# EAGLE design MultiPD (EAGLE 5.10)
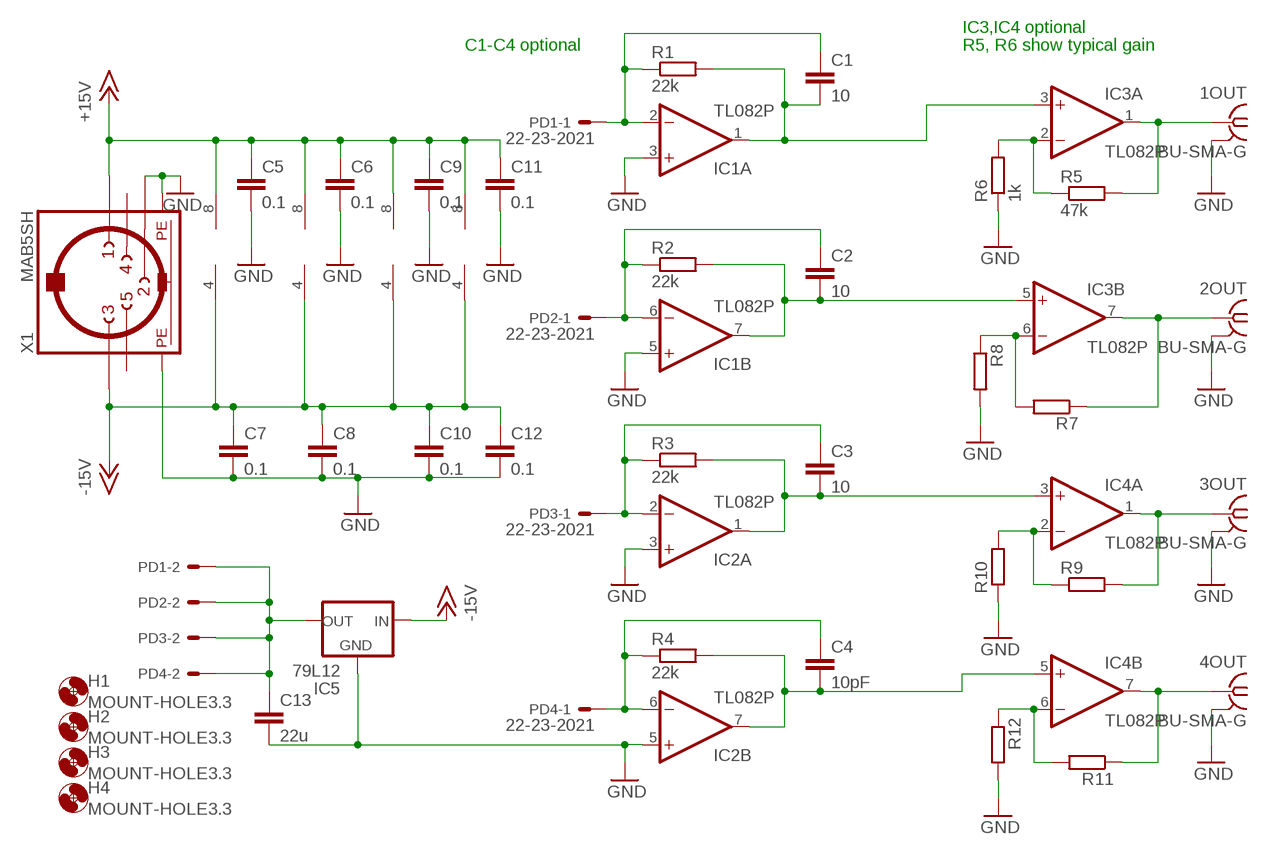
[diagram p0: schematic, sheet 1]

## Parts
1OUT  BU-SMA-G  [BU-SMA-G]
2OUT  BU-SMA-G  [BU-SMA-G]
3OUT  BU-SMA-G  [BU-SMA-G]
4OUT  BU-SMA-G  [BU-SMA-G]
C1  10  C-EU050-035X075  [C050-035X075]
C2  10  C-EU050-035X075  [C050-035X075]
C3  10  C-EU050-035X075  [C050-035X075]
C4  10pF  C-EU050-035X075  [C050-035X075]
C5  0.1  C-EU025-030X050  [C025-030X050]
C6  0.1  C-EU025-030X050  [C025-030X050]
C7  0.1  C-EU025-030X050  [C025-030X050]
C8  0.1  C-EU025-030X050  [C025-030X050]
C9  0.1  C-EU025-030X050  [C025-030X050]
C10  0.1  C-EU025-030X050  [C025-030X050]
C11  0.1  C-EU025-030X050  [C025-030X050]
C12  0.1  C-EU025-030X050  [C025-030X050]
C13  22u  C-EU050-025X075  [C050-025X075]
H1  MOUNT-HOLE3.3  [3,3]
H2  MOUNT-HOLE3.3  [3,3]
H3  MOUNT-HOLE3.3  [3,3]
H4  MOUNT-HOLE3.3  [3,3]
IC1  TL082P  [DIL08]
IC2  TL082P  [DIL08]
IC3  TL082P  [DIL08]
IC4  TL082P  [DIL08]
IC5  79L12  79LXX  [79LXX]
PD1  22-23-2021  [22-23-2021]
PD2  22-23-2021  [22-23-2021]
PD3  22-23-2021  [22-23-2021]
PD4  22-23-2021  [22-23-2021]
R1  22k  R-EU_0207/10  [0207/10]
R2  22k  R-EU_0207/10  [0207/10]
R3  22k  R-EU_0207/10  [0207/10]
R4  22k  R-EU_0207/10  [0207/10]
R5  47k  R-EU_0207/10  [0207/10]
R6  1k  R-EU_0207/10  [0207/10]
R7  R-EU_0207/10  [0207/10]
R8  R-EU_0207/10  [0207/10]
R9  R-EU_0207/10  [0207/10]
R10  R-EU_0207/10  [0207/10]
R11  R-EU_0207/10  [0207/10]
R12  R-EU_0207/10  [0207/10]
X1  MAB5SH  [MAB5SH]

## Nets
+15V: C5.1 C6.1 C9.1 C11.1 IC1.8(P:V+) IC2.8(P:V+) IC3.8(P:V+) IC4.8(P:V+) X1.1
-15V: C7.1 C8.1 C10.1 C12.1 IC1.4(P:V-) IC2.4(P:V-) IC3.4(P:V-) IC4.4(P:V-) IC5.IN X1.3
GND: 1OUT.2(GND) 2OUT.2(GND) 3OUT.2(GND) 4OUT.2(GND) C5.2 C6.2 C7.2 C8.2 C9.2 C10.2 C11.2 C12.2 C13.2 IC1.3(A:+IN) IC1.5(B:+IN) IC2.3(A:+IN) IC2.5(B:+IN) IC5.GND R6.1 R8.2 R10.1 R12.2 X1.2 X1.PE X1.PE@(PE)
N$1: C1.1 IC1.2(A:-IN) PD1.1 R1.1
N$2: C2.1 IC1.6(B:-IN) PD2.1 R2.1
N$3: C3.1 IC2.2(A:-IN) PD3.1 R3.1
N$4: C4.1 IC2.6(B:-IN) PD4.1 R4.1
N$5: C1.2 IC1.1(A:OUT) IC3.3(A:+IN) R1.2
N$6: C2.2 IC1.7(B:OUT) IC3.5(B:+IN) R2.2
N$7: C3.2 IC2.1(A:OUT) IC4.3(A:+IN) R3.2
N$8: C4.2 IC2.7(B:OUT) IC4.5(B:+IN) R4.2
N$9: IC3.2(A:-IN) R5.1 R6.2
N$10: IC3.6(B:-IN) R7.2 R8.1
N$11: IC4.2(A:-IN) R9.1 R10.2
N$12: IC4.6(B:-IN) R11.2 R12.1
N$13: 1OUT.1 IC3.1(A:OUT) R5.2
N$14: 2OUT.1 IC3.7(B:OUT) R7.1
N$15: 3OUT.1 IC4.1(A:OUT) R9.2
N$16: 4OUT.1 IC4.7(B:OUT) R11.1
N$17: C13.1 IC5.OUT PD1.2 PD2.2 PD3.2 PD4.2
Unconnected: X1.4 X1.5

## Notes on the sheet
- IC3,IC4 optional
- C1-C4 optional | R5, R6 show typical gain

## Power pins joined to a net without a drawn wire
GND: 1OUT.3(GND) 1OUT.4(GND) 1OUT.5(GND) 2OUT.3(GND) 2OUT.4(GND) 2OUT.5(GND) 3OUT.3(GND) 3OUT.4(GND) 3OUT.5(GND) 4OUT.3(GND) 4OUT.4(GND) 4OUT.5(GND)

## Library data of the parts
1OUT 2OUT 3OUT 4OUT = con-coax:BU-SMA-G: FEMALE SMA CONNECTOR Radiall distributor RS 193-9117
C1-C13 = rcl:C-EU: CAPACITOR, European symbol
H1-H4 = holes:MOUNT-HOLE: MOUNTING HOLE with drill center marker
IC1-IC4 = linear:TL082: OP AMP
IC5 = v-reg:79LXX: VOLTAGE REGULATOR
PD1-PD4 = con-molex:22-23-2021: .100" (2.54mm) Center Header - 2 Pin
R1-R12 = rcl:R-EU_: RESISTOR, European symbol
X1 = con-hirschmann:MAB5SH: Female CONNECTOR 5 pins 90 deg. with shield, horizontal (DIN 41524)

## Board
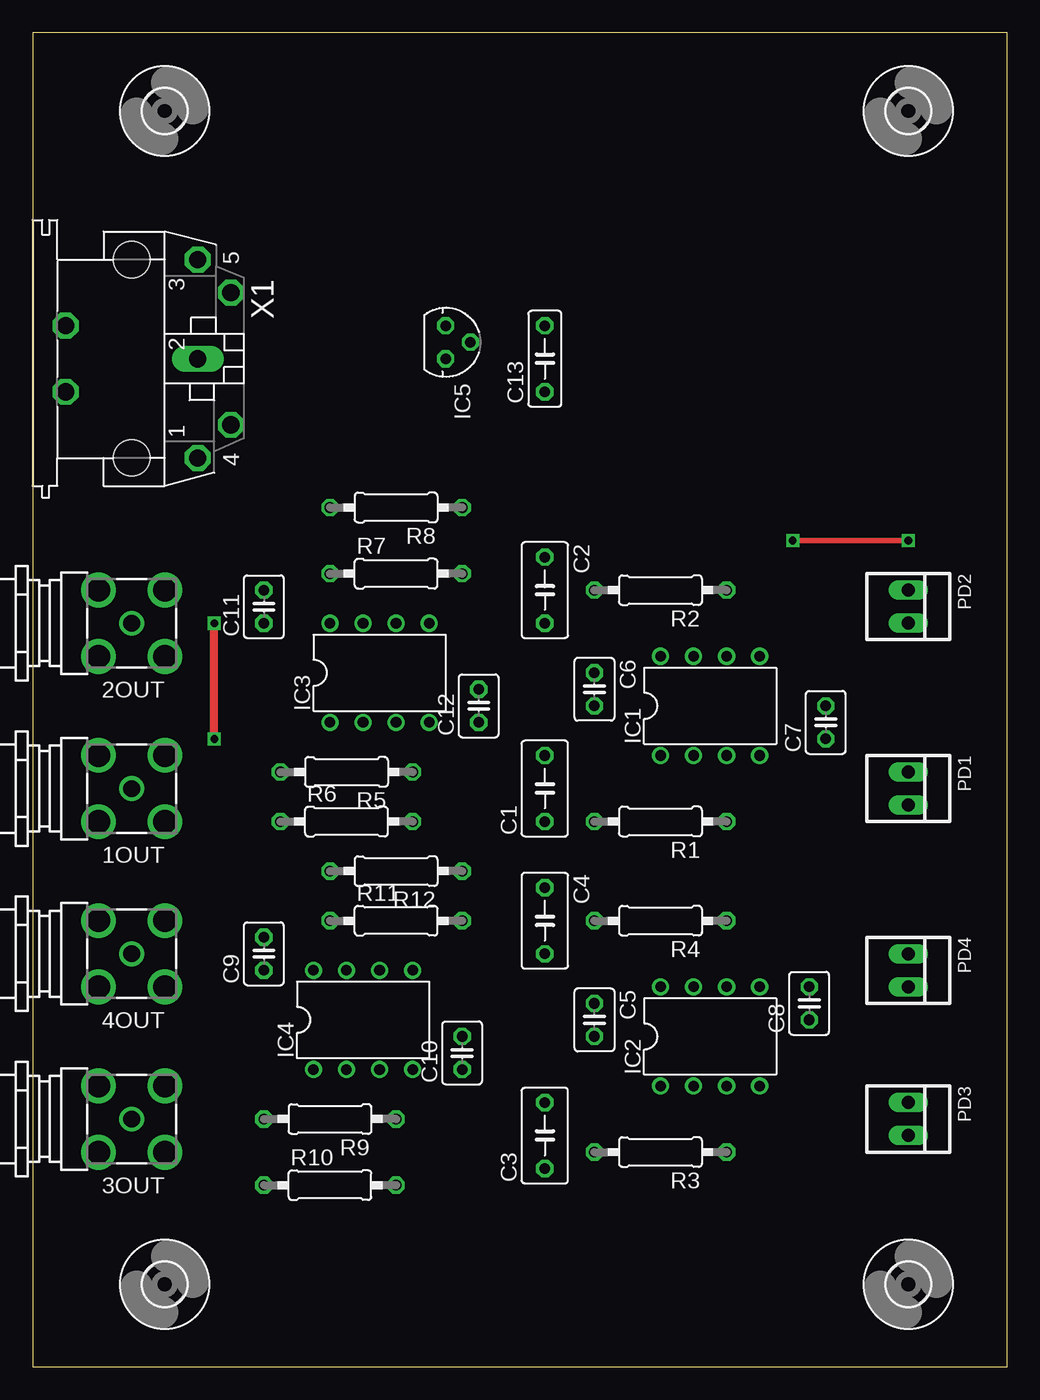
[diagram p1: board, top side]
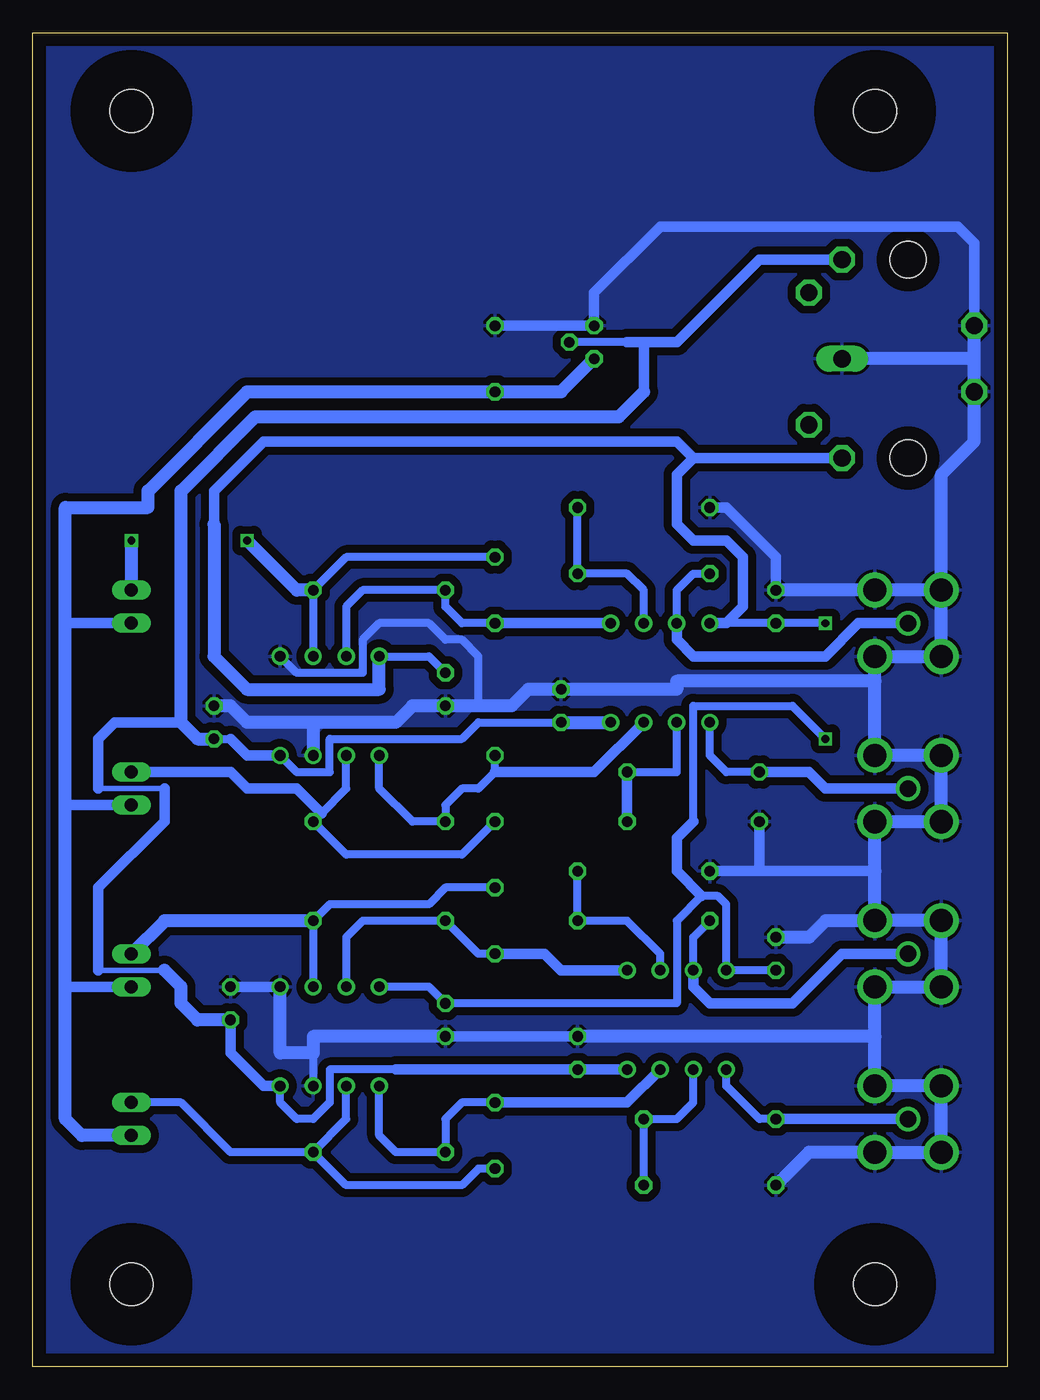
[diagram p2: board, bottom side, seen from below]

Size 74.91 x 102.54 mm. Coordinates in mm from the lower left corner, seen from the top.
Outline: 0,0 74.91,0 74.91,102.54 0,102.54 0,0
Copper layers (1*16): Top 0.035mm / dielectric 1.5mm / Bottom 0.035mm
Design rules "default": minimum track width 10mil, minimum drill 24mil, track to track 8mil, track to pad 8mil, pad to pad 8mil, via to via 8mil, smd to smd 8mil, copper to edge 40mil, drill to drill 8mil, minimum pad ring 10mil, minimum via ring 8mil, stop-mask expansion 4mil, vias tented up to drill 0mil, thermal gap 10mil

### Footprints (pad centres in the part's own frame; a part is rotated, then mirrored left to right if it is on the bottom)
BU-SMA-G = drill 1.27 round: 1 0,0 | drill 1.778 round: 2 -2.55,2.55; 3 2.55,2.55; 4 2.55,-2.55; 5 -2.55,-2.55
C050-035X075 = drill 0.813 octagon: 1 -2.54,0; 2 2.54,0
C025-030X050 = drill 0.813 octagon: 1 -1.27,0; 2 1.27,0
C050-025X075 = drill 0.813 octagon: 1 -2.54,0; 2 2.54,0
3,3 = hole 3.3: 0,0
DIL08 = drill 0.813 pad 1.27 round: 1 -3.81,-3.81; 2 -1.27,-3.81; 3 1.27,-3.81; 4 3.81,-3.81; 5 3.81,3.81; 6 1.27,3.81; 7 -1.27,3.81; 8 -3.81,3.81
79LXX = drill 0.813 octagon: GND -1.27,0; IN 0,1.905; OUT 1.27,0
22-23-2021 = drill 1 long: 1 -1.27,0; 2 1.27,0
0207/10 = drill 0.813 octagon: 1 -5.08,0; 2 5.08,0
MAB5SH = drill 1.321 octagon: 1 7.62,5.08; 3 -7.62,5.08; 4 5.08,7.62; 5 -5.08,7.62; PE -2.54,-5.08; PE@ 2.54,-5.08 | drill 1.321 long: 2 0,5.08 | hole 2.794: 7.62,0; -7.62,0

### Placement (x,y rotation side)
1OUT  7.62,44.45 180 top
2OUT  7.62,57.15 180 top
3OUT  7.62,19.05 180 top
4OUT  7.62,31.75 180 top
C1  39.37,44.45 90 top
C2  39.37,59.69 270 top
C3  39.37,17.78 90 top
C4  39.37,34.29 270 top
C5  43.18,26.67 270 top
C6  43.18,52.07 270 top
C7  60.96,49.53 90 top
C8  59.69,27.94 90 top
C9  17.78,31.75 90 top
C10  33.02,24.13 90 top
C11  17.78,58.42 90 top
C12  34.29,50.8 90 top
C13  39.37,77.47 90 top
H1  67.31,96.52 0 top
H2  10.16,6.35 0 top
H3  67.31,6.35 0 top
H4  10.16,96.52 0 top
IC1  52.07,50.8 0 top
IC2  52.07,25.4 0 top
IC3  26.67,53.34 0 top
IC4  25.4,26.67 0 top
IC5  31.75,78.74 270 top
PD1  67.31,44.45 270 top
PD2  67.31,58.42 270 top
PD3  67.31,19.05 270 top
PD4  67.31,30.48 270 top
R1  48.26,41.91 180 top
R2  48.26,59.69 180 top
R3  48.26,16.51 180 top
R4  48.26,34.29 180 top
R5  24.13,45.72 180 top
R6  24.13,41.91 0 top
R7  27.94,60.96 0 top
R8  27.94,66.04 180 top
R9  22.86,19.05 180 top
R10  22.86,13.97 0 top
R11  27.94,34.29 0 top
R12  27.94,38.1 180 top
X1  7.62,77.47 270 top

### Tracks (layer width: path | path; a pad name or v marks a point on that pad's centre or on a via)
+15V  (via drill 0.6)
  Top 0.61: v13.97,48.26 v13.97,57.15
  Bottom 0.61: C6.1 44.45,54.61 IC1.8 | IC2.8 44.45,29.21 C5.1 25.4,27.94 25.4,34.29 23.5,36.2 22.22,36.2 21.59,35.56 IC4.8 C9.1 | IC3.8 C11.1 v13.97,57.15 | 24.13,41.91 24.13,50.8 16.51,50.8 v13.97,48.26
  Bottom 0.813: 60.96,64.77 60.96,67.31 57.15,71.12 25.4,71.12 24.13,69.85 | 24.13,69.85 X1.1 | IC3.8 21.59,57.15 20.32,58.42 20.32,62.23 21.59,63.5 24.13,63.5 25.4,64.77 25.4,68.58 24.13,69.85 | 23.5,36.2 25.4,38.1 25.4,40.64 24.13,41.91
  Bottom 1.016: IC1.8 48.26,52.07 58.42,52.07 60.96,54.61 60.96,64.77
-15V
  Bottom 0.406: 64.77,30.48 69.85,30.48 | 64.77,44.45 69.85,44.45
  Bottom 0.61: C7.1 59.69,48.26 | 29.21,78.74 IC5.IN | 46.99,22.86 52.07,22.86 52.07,20.32 53.34,19.05 54.61,19.05 55.88,20.32 IC2.4 | IC1.4 54.61,45.72 52.07,45.72 52.07,48.26 41.91,48.26 40.64,49.53 C12.1
  Bottom 0.813: 59.69,48.26 58.42,46.99 IC1.4 | IC2.4 57.15,21.59 59.69,24.13 C8.1 | IC4.4 C10.1 46.99,22.86 | X1.3 19.05,85.09 25.4,78.74 27.94,78.74 | 27.94,78.74 29.21,78.74 | 27.94,74.93 27.94,78.74 | 69.85,30.48 69.85,36.83 64.77,41.91 64.77,44.45 | 69.85,44.45 69.85,48.26 68.58,49.53 63.5,49.53
  Bottom 1.016: C7.1 62.23,48.26 63.5,49.53 63.5,67.31 57.78,73.02 29.84,73.02 27.94,74.93 | C12.1 IC3.4 | C8.1 62.23,26.67 63.5,27.94 63.5,29.21 64.77,30.48
GND
  Bottom 0.61: 53.34,24.13 IC2.3 | IC1.5 54.61,53.34 49.53,53.34 49.53,55.88 48.26,57.15 44.45,57.15 43.18,55.88 41.91,55.88 40.64,54.61 40.64,50.8
  Bottom 0.813: 10.17,38.1 19.05,38.1 | 19.05,38.1 R12.2 | 19.05,38.1 R6.1 | C11.2 17.78,62.23 21.59,66.04 R8.2 | C13.2 IC5.GND 31.75,82.55 26.67,87.63 3.81,87.63 2.54,86.36 X1.PE | IC2.5 C8.2 | C10.2 C5.2
  Bottom 1.016: 53.34,49.53 46.99,49.53 45.72,50.8 C6.2 40.64,50.8 38.1,50.8 36.83,52.07 C12.2 25.4,52.07 25.4,52.7 10.17,52.7 | 53.34,49.53 IC1.3 | 53.34,49.53 58.42,49.53 59.69,50.8 C7.2 | 2OUT.4 2OUT.5 C11.2 | 2OUT.4 2OUT.3 2OUT.2 1OUT.5 1OUT.4 1OUT.3 1OUT.2 10.17,38.1 4OUT.5 | 4OUT.5 4OUT.4 4OUT.3 4OUT.2 10.17,25.4 | IC2.5 55.88,24.13 53.34,24.13 53.34,25.4 C5.2 | 10.17,25.4 3OUT.5 3OUT.4 3OUT.3 3OUT.2 15.24,16.51 R10.1 | C9.2 15.24,33.02 13.97,34.29 4OUT.5 | 2OUT.4 5.07,68.59 2.54,71.12 X1.PE@ 2.54,77.47 | 2.54,77.47 X1.PE | 2.54,77.47 X1.2 | 10.17,25.4 C10.2
  pour Bottom (isolate 0.61): 0,0 0,102.87 74.93,102.87 74.93,101.6 74.93,0
N$1
  Bottom 0.61: IC1.2 50.8,44.45 52.7,42.55 R1.1 50.8,39.37 41.91,39.37 C1.1
  Bottom 0.813: PD1.1 59.69,45.72 58.42,44.45 54.61,44.45 52.7,42.55
N$2  (via drill 0.6)
  Top 0.406: v58.42,63.5 v67.31,63.5
  Bottom 0.61: IC1.6 R2.1 50.8,62.23 C2.1
  Bottom 1.016: R2.1 54.61,59.69 v58.42,63.5 | v67.31,63.5 PD2.1
N$3
  Bottom 0.61: IC2.2 50.8,19.05 R3.1 | R3.1 59.69,16.51 63.5,20.32 PD3.1 | C3.1 40.64,15.24 41.91,13.97 50.8,13.97 R3.1
N$4
  Bottom 0.61: IC2.6 R4.1 52.07,35.56 44.45,35.56 43.18,36.83 C4.1
  Bottom 1.016: PD4.1 64.77,34.29 R4.1
N$5
  Bottom 0.61: IC1.1 48.26,44.45 45.72,41.91 R1.2 43.18,43.18 41.91,44.45 40.64,44.45 39.37,45.72 C1.2
  Bottom 0.813: IC3.3 31.75,45.72 39.37,45.72
N$6
  Bottom 0.61: IC1.7 50.8,58.42 49.53,59.69 R2.2 43.18,58.42 41.91,57.15 C2.2
  Bottom 0.813: IC3.5 C2.2
N$7
  Bottom 0.61: IC2.1 48.26,17.78 46.99,16.51 R3.2 43.18,19.05 41.91,20.32 C3.2
  Bottom 0.813: IC4.3 29.21,20.32 C3.2
N$8
  Bottom 0.61: IC2.7 50.8,33.02 49.53,34.29 R4.2 40.64,31.75 C4.2
  Bottom 0.813: IC4.5 34.29,30.48 35.56,31.75 C4.2
N$9
  Bottom 0.61: IC3.2 25.4,45.72 R5.1
  Bottom 0.813: R6.2 R5.1
N$10
  Bottom 0.61: IC3.6 27.94,59.69 29.21,60.96 R7.2 R8.1
N$11
  Bottom 0.61: IC4.2 24.13,20.32 25.4,19.05 R9.1 R10.2
N$12
  Bottom 0.61: IC4.6 26.67,31.75 29.21,34.29 R11.2 R12.1
N$13
  Bottom 0.61: R5.2 21.59,45.72 22.86,46.99 IC3.1
  Bottom 0.813: 1OUT.1 13.97,44.45 15.24,45.72 R5.2
N$14
  Bottom 0.61: IC3.7 25.4,59.69 24.13,60.96 R7.1
  Bottom 0.813: 2OUT.1 11.43,57.15 13.97,54.61 24.13,54.61 25.4,55.88 IC3.7
N$15
  Bottom 0.61: R9.2 19.05,19.05 21.59,21.59 IC4.1
  Bottom 0.813: 3OUT.1 R9.2
N$16
  Bottom 0.61: IC4.7 24.13,33.02 R11.1
  Bottom 0.813: 4OUT.1 12.7,31.75 16.51,27.94 22.86,27.94 24.13,29.21 IC4.7
N$17
  Bottom 0.813: 72.39,57.15 PD2.2 | 72.39,43.18 PD1.2 | 72.39,29.21 PD4.2
  Bottom 1.016: IC5.OUT 34.29,74.93 C13.1 58.42,74.93 66.04,67.31 66.04,66.04 72.39,66.04 72.39,57.15 72.39,43.18 72.39,29.21 72.39,19.05 71.12,17.78 PD3.2